# Altium schematic sheet Flash.SchDoc
size A4
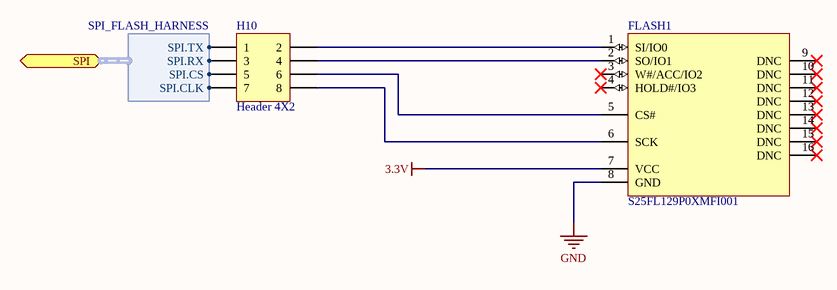
[diagram p0: Flash.SchDoc]

## Parts
FLASH1  S25FL129P0XMFI001  [SOIC-16-FLASH]
H10  Header 4X2  [HDR2X4]

## Ports
SPI (harness SPI_FLASH_HARNESS)

## Harnesses
SPI_FLASH_HARNESS: SPI.TX, SPI.RX, SPI.CLK, SPI.CS

## Nets
3.3V: FLASH1.7(VCC)
GND: FLASH1.8(GND)
NetFLASH1_1: FLASH1.1(SI/IO0) H10.2
NetFLASH1_2: FLASH1.2(SO/IO1) H10.4
NetFLASH1_5: FLASH1.5(CS#) H10.6
NetFLASH1_6: FLASH1.6(SCK) H10.8
NetH10_1: H10.1 ; port SPI.SPI.TX
NetH10_3: H10.3 ; port SPI.SPI.RX
NetH10_5: H10.5 ; port SPI.SPI.CS
NetH10_7: H10.7 ; port SPI.SPI.CLK

Not connected (* = marked no-connect by the designer): FLASH1 3(W#/ACC/IO2)* 4(HOLD#/IO3)* 9(DNC)* 10(DNC)* 11(DNC)* 12(DNC)* 13(DNC)* 14(DNC)* 15(DNC)* 16(DNC)*

## Library data of the parts
FLASH1 = S25FL129P0XMFI001: pin to pad: 1>15 2>8 3>9 4>1 5>7 6>16 7>2 8>10 9>3 10>4 11>5 12>6 13>11 14>12 15>13 16>14
H10 = Header 4X2: Header, 4-Pin, Dual row; LatestRevisionDate: 17-Jul-2002; LatestRevisionNote: Re-released for DXP Platform.; Publisher: Altium Limited